# Altium schematic sheet LEDs.SchDoc
size A; SheetNumber: 5; SheetTotal: 9
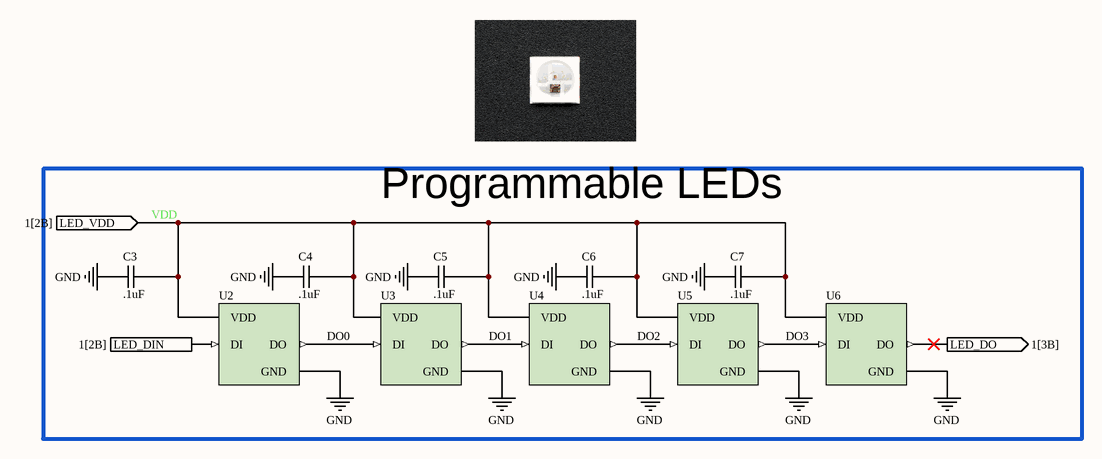
[diagram p0: LEDs.SchDoc]

## Parts
C3  value .1uF  [PCB-CAP-SMD-0603]  (hidden comment: CAP-SMD-0603)
C4  value .1uF  [PCB-CAP-SMD-0603]  (hidden comment: CAP-SMD-0603)
C5  value .1uF  [PCB-CAP-SMD-0603]  (hidden comment: CAP-SMD-0603)
C6  value .1uF  [PCB-CAP-SMD-0603]  (hidden comment: CAP-SMD-0603)
C7  value .1uF  [PCB-CAP-SMD-0603]  (hidden comment: CAP-SMD-0603)
U2  LED-RGB-SK6812B-3535  [PCB-SK6812B-3535-SMD-3.5X3.7MM]  (value not drawn)
U3  LED-RGB-SK6812B-3535  [PCB-SK6812B-3535-SMD-3.5X3.7MM]  (value not drawn)
U4  LED-RGB-SK6812B-3535  [PCB-SK6812B-3535-SMD-3.5X3.7MM]  (value not drawn)
U5  LED-RGB-SK6812B-3535  [PCB-SK6812B-3535-SMD-3.5X3.7MM]  (value not drawn)
U6  LED-RGB-SK6812B-3535  [PCB-SK6812B-3535-SMD-3.5X3.7MM]  (value not drawn)

## Blocks framed on the sheet
Programmable LEDs: C3-C7 U2-U6

## Ports
LED_DIN (in, see 1[2B]), LED_DO (out, see 1[3B]), LED_VDD (in, see 1[2B])

## Nets
GND: C3.1 C4.1 C5.1 C6.1 C7.1 U2.4(GND) U3.4(GND) U4.4(GND) U5.4(GND) U6.4(GND)
DO0: U2.3(DO) U3.1(DI)
DO1: U3.3(DO) U4.1(DI)
DO2: U4.3(DO) U5.1(DI)
DO3: U5.3(DO) U6.1(DI)
LED_DIN: U2.1(DI) ; port LED_DIN
LED_DO: U6.3(DO) ; port LED_DO
VDD: C3.2 C4.2 C5.2 C6.2 C7.2 U2.2(VDD) U3.2(VDD) U4.2(VDD) U5.2(VDD) U6.2(VDD) ; port LED_VDD

## Library data of the parts
C3-C7 = CMP-00006-5: Generic (no part number) 0603 surface mount capacitor
U2-U6 = CMP-018-000000-9: 3.5x3.7x1.1 mm 0.2W Intelligent external control surface; SymbolName_1: WS2812BLED; DeviceSetName: WS2812B; DeviceName: 3535; GateName_1: G$1; LibraryName: adafruit; Package: LED3535; Source: adafruit.SCHLIB; Pin Count: 4; Design Item ID: WS2812B3535; Component Type: Standard